# EAGLE schematic Pool Interface (EAGLE 9.4.0)
REV: 0.1
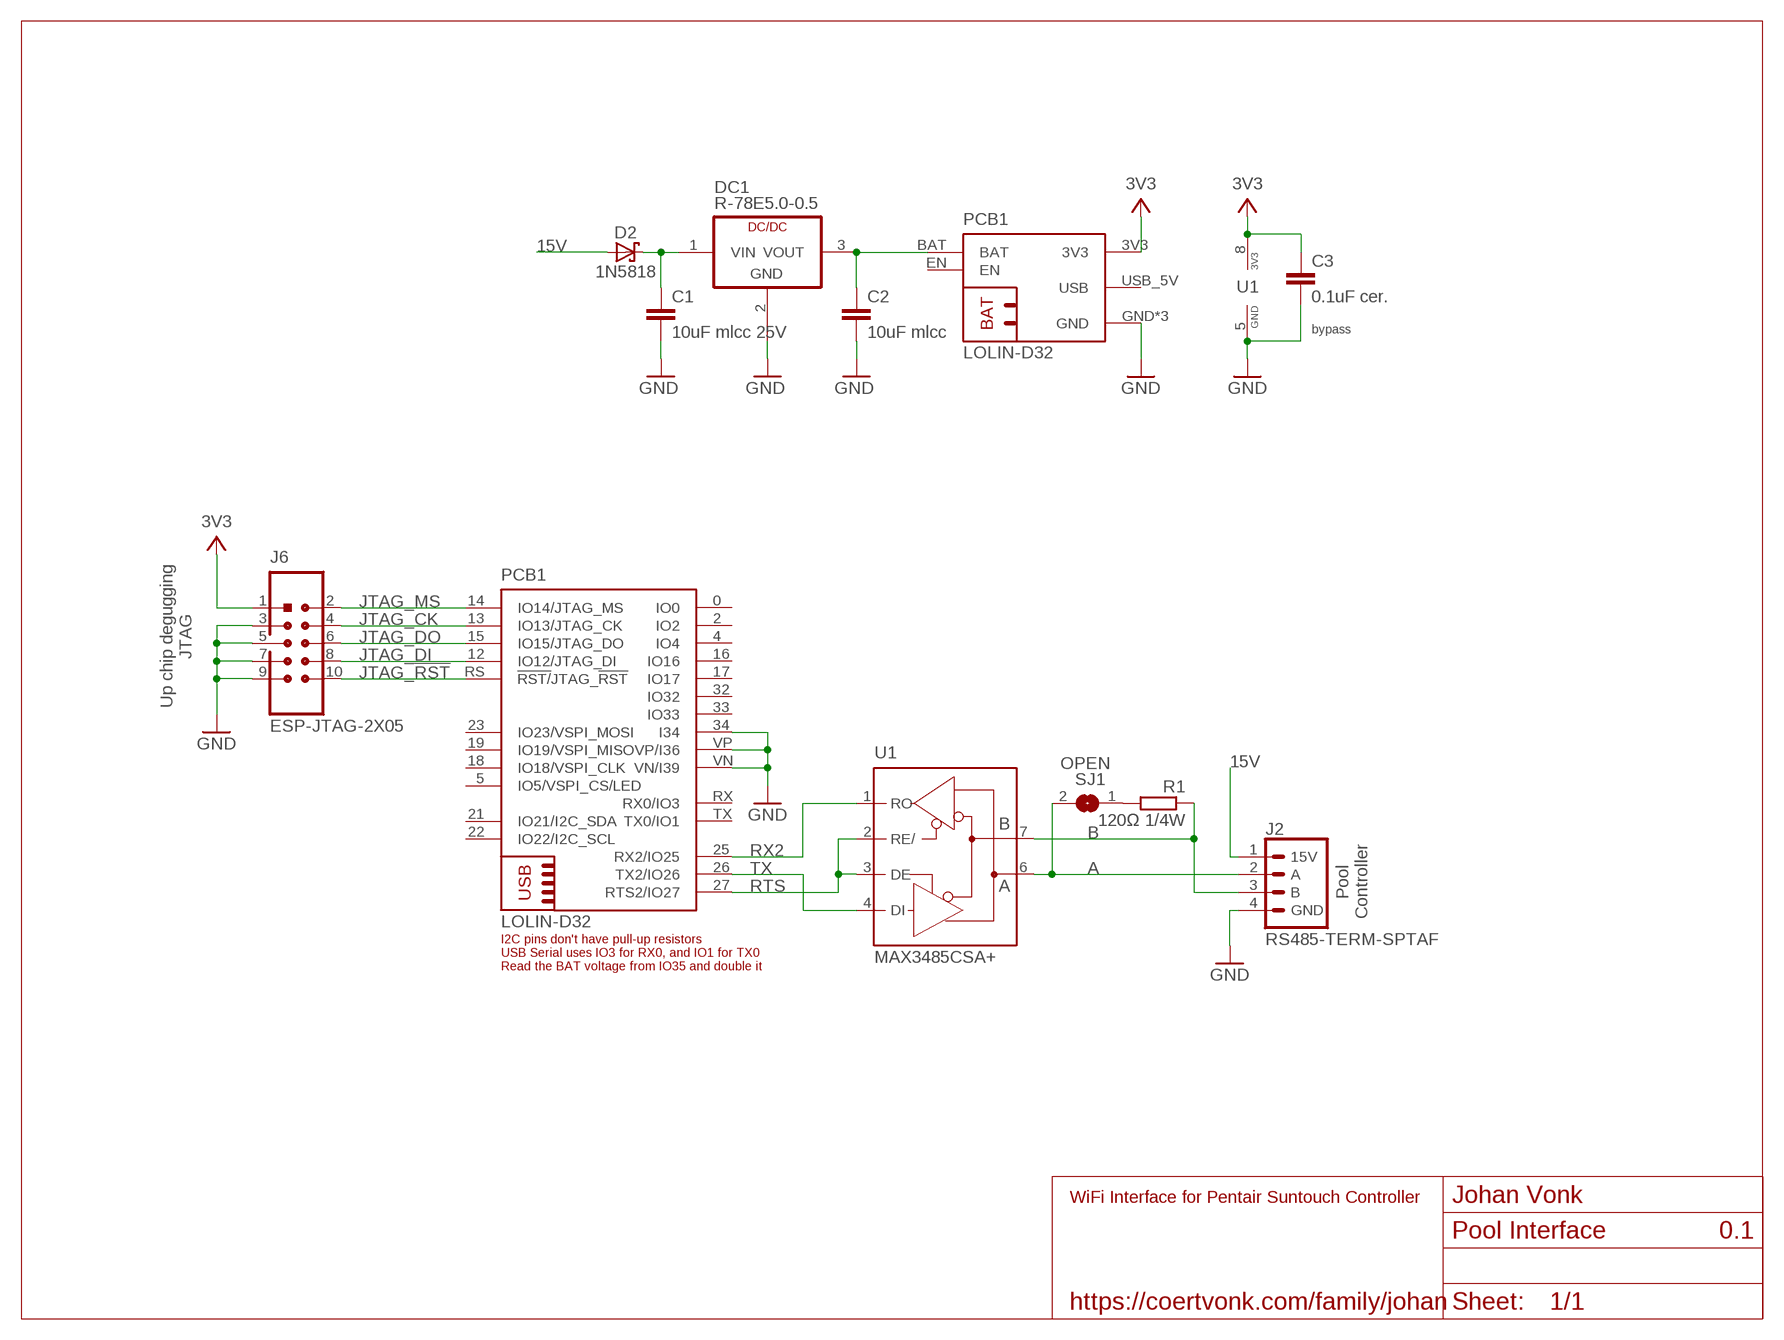
[diagram p0: schematic, sheet 1]
U$1 (FRAME_LETTER_L): AUTHOR_NAME: Johan Vonk; DESCRIPTION: WiFi Interface for Pentair Suntouch Controller; REV: 0.1; URL: https://coertvonk.com/family/johan

## Parts
C1  10uF mlcc 25V  C-EUC0805K  [C0805K]
C2  10uF mlcc  C-EUC0805K  [C0805K]
C3  0.1uF cer.  C-EUC0805K  [C0805K]
D2  1N5818  [DO41-7.6]
DC1  R-78E5.0-0.5  [SIP3]
J2  RS485-TERM-SPTAF  [SPTAF1/4-5,0-LL]
J6  ESP-JTAG-2X05  [2X05_SHROUDED]
PCB1  LOLIN-D32  [LOLIN-D32]
R1  120Ω 1/4W  R-EU_R0805  [R0805]
SJ1  OPEN  SJ  [SJ]
U1  MAX3485CSA+  [SO08]

## Nets
3V3: C3.1 J6.1(3V3) PCB1.3V3(P:3V3) U1.8(P:VCC)
15V: D2.A J2.1(15V)
A: J2.2(A) SJ1.2 U1.6(A)
B: J2.3(B) R1.1 U1.7(B)
GND: C1.2 C2.2 C3.2 DC1.2(GND) J2.4(GND) J6.3(GND) J6.5(GND) J6.7(GND) J6.9(GND) PCB1.34(I34) PCB1.GND(P:GND) PCB1.GND@1(P:GND) PCB1.GND@2(P:GND) PCB1.VN(VN/I39) PCB1.VP(VP/I36) U1.5(P:GND)
JTAG_!RST: J6.10(NC) PCB1.RS(!RST/!JTAG_!RST)
JTAG_CK: J6.4(TCK) PCB1.13(IO13/JTAG_CK)
JTAG_DI: J6.8(TDI) PCB1.12(IO12/JTAG_DI)
JTAG_DO: J6.6(TDO) PCB1.15(IO15/JTAG_DO)
JTAG_MS: J6.2(TMS) PCB1.14(IO14/JTAG_MS)
N$5: R1.2 SJ1.1
RTS: PCB1.27(RTS2/IO27) U1.2(RE/) U1.3(DE)
RX2: PCB1.25(RX2/IO25) U1.1(RO)
TX: PCB1.26(TX2/IO26) U1.4(DI)
VIN: C1.1 D2.C DC1.1(VIN)
VOUT: C2.1 DC1.3(VOUT) PCB1.BAT(P:BAT)
Unconnected: PCB1.0(IO0) PCB1.2(IO2) PCB1.4(IO4) PCB1.5(IO5/VSPI_CS/LED) PCB1.16(IO16) PCB1.17(IO17) PCB1.18(IO18/VSPI_CLK) PCB1.19(IO19/VSPI_MISO) PCB1.21(IO21/I2C_SDA) PCB1.22(IO22/I2C_SCL) PCB1.23(IO23/VSPI_MOSI) PCB1.32(IO32) PCB1.33(IO33) PCB1.EN(P:EN) PCB1.RX(RX0/IO3) PCB1.TX(TX0/IO1) PCB1.USB_5V(P:USB)

## Notes on the sheet
- bypass
- Up chip degugging
  JTAG
- Pool
  Controller

## Library data of the parts
C1 C2 = rcl:C-EU: CAPACITOR, European symbol; MANF: Murata Electronics; MANF#: GJ821BR61E106KE11L; MOUSER#: 81-GJ821BR61E106KE1L; SPICEPREFIX: C
C3 = rcl:C-EU: CAPACITOR, European symbol; MANF: KEMET; MANF#: C0805C104K1RECAUTO; MOUSER#: 80-C0805C104K1REAUTO; SPICEPREFIX: C
D2 = Coert Vonk:1N581*: 1.0A SCHOTTKY BARRIER RECTIFIER Source: http://www.diodes.com/datasheets/ds23001.pdf; MANF: Rectron; MANF#: 1N5818-T; MOUSER#: 583-1N5818-T
DC1 = Coert Vonk:R-78E*-0.5: DC/DC-Converter 5V 500 mA Technical specifications: Manufacturer: Recom Input Voltage: 7 - 28 V Output Voltage: 5 V Output Current: 500 mA Mfr.: R-78E5.0-0.5, data sheet <http://www.recom-power.com/pdf/Innoline/R-78Exx-0.5.pdf> Mouser: 919-R-78E5.0-0.5, abt. $2.70; MANF: RECOM Power; MANF#: R-78E5.0-0.5; MOUSER#: 919-R-78E5.0-0.5
J2 = Coert Vonk:RS485-TERM: SPTAF 1/ 4-5,0-LL - 1864451, PCB push terminal block Technical specifications: Manufacturer: Phoenix Contact Current Rating: 13.5 A Voltage Rating: 320 V Wire Gauge Range: 24 AWG to 18 AWG Mfr.#: 1864451 Mouser: 651-1864451, abt. $1.85; MANF: Phoenix Contact; MANF#: 1864451; MOUSER#: 651-1864451
J6 = Coert Vonk:ESP-JTAG: 10-pin JTAG Header, shrouded header, 2-row, 2.54 pitch Specifications: Manufacturer: Molex Voltage rating: 250 VDC Current rating: 2.5 A Operating temperature: -55 - 120 C Mfr.#: 70246-1004 Mouser #: 538-70246-1004, about $1.19, data sheet <https://www.mouser.com/datasheet/2/276/0702461004_PCB_HEADERS-229930.pdf>; DIGIKEY#: WM3478-ND; MANF: Molex; MANF#: 70246-1004; MOUSER#: 538-70246-1004
PCB1 = Coert Vonk:LOLIN-D32: Wemos LOLIN D32, ESP-WROOM-32 Technical specifications: Manufacturer: Wemos SoC: ESP32-WROOM-32, 4 MByte flash, max 240MHz Optional battery: 3.7V Lipo, connector PH-2(2.0mm) UART: CH340, micro-USB connector Mfr.#: LOLIN D32, data sheet <https://wiki.wemos.cc/products:d32:d32> Alibaba: 32808551116, about $6.50; ALIEXPRESS#: 32808551116; MANF: WEMOS Electronics; MANF#: D32
R1 = rcl:R-EU_: RESISTOR, European symbol; MANF: Bourns; MANF#: CRM0805-JW-1R5ELF; MOUSER#: 652-CRM0805JW1R5ELF; SPICEPREFIX: R
SJ1 = jumper:SJ: SMD solder JUMPER
U1 = Coert Vonk:MAX3485CSA+: RS-485 Transceiver 3.3V SMD Technical specifications: Manufacturer: Maxim Integrated Operating supply: 3.3 V, 1.1 mA Output: 3 V, 20 mA Data rate: 10 Mb/s Temperature range: 0 - 70 C Mfr.: R-78E5.0-0.5 Mouser: 919-R-78E5.0-0.5, abt. $2.70, details <https://www.mouser.com/ProductDetail/Maxim-Integrated/MAX3485CSA%2b>; MANF: Maxim Integrated; MANF#: MAX3485CSA+; MF: MAXIM; MOUSER#: 700-MAX3485CSA; MPN: MAX481CSA; OC_FARNELL: unknown; OC_NEWARK: 90C3817